# Altium project Compuertas.PrjPcb
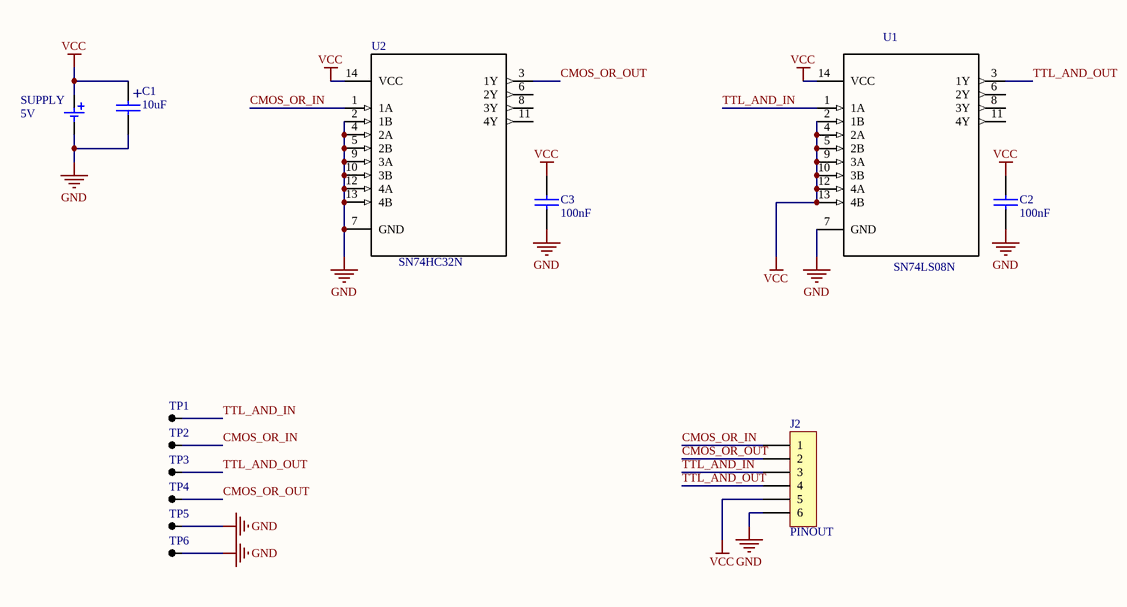
[diagram p0: Compuertas_SCH.SchDoc]
1 sheet, 13 parts. Net scope: global (net labels, ports and power ports of the same name join across sheets).
Board file: Compuertas_PCB.PcbDoc

## Sheet Compuertas_SCH.SchDoc
size A4

### Parts
C1  10uF  [CAP100RP]
C2  100nF  [0805]
C3  100nF  [0805]
J2  PINOUT  [SIP6]
SUPPLY  5V  [BORNERA2]
TP1  TP  [TPTH]  (value not drawn)
TP2  TP  [TPTH]  (value not drawn)
TP3  TP  [TPTH]  (value not drawn)
TP4  TP  [TPTH]  (value not drawn)
TP5  TP  [TPTH]  (value not drawn)
TP6  TP  [TPTH]  (value not drawn)
U1  SN74LS08N  [*DIP254P762X508-14]
U2  SN74HC32N  [*DIP254P762X508-14]

### Nets
GND: C1.2 C2.2 C3.2 J2.6 SUPPLY.2 TP5.1 TP6.1 U1.7(GND) U2.2(1B) U2.4(2A) U2.5(2B) U2.7(GND) U2.9(3A) U2.10(3B) U2.12(4A) U2.13(4B)
VCC: C1.1 C2.1 C3.1 J2.5 SUPPLY.1 U1.2(1B) U1.4(2A) U1.5(2B) U1.9(3A) U1.10(3B) U1.12(4A) U1.13(4B) U1.14(VCC) U2.14(VCC)
CMOS_OR_IN: J2.1 TP2.1 U2.1(1A)
CMOS_OR_OUT: J2.2 TP4.1 U2.3(1Y)
TTL_AND_IN: J2.3 TP1.1 U1.1(1A)
TTL_AND_OUT: J2.4 TP3.1 U1.3(1Y)

Not connected (* = marked no-connect by the designer): U1 6(2Y) 8(3Y) 11(4Y); U2 6(2Y) 8(3Y) 11(4Y)

### Notes on the sheet
- (in symbol CAPPOL) +

### Library data of the parts
C1 = CAPPOL: Value: Electrolítico 10uF; Footprint: THT
C2 C3 = CAP: Value: Cerámico 100nF; Footprint: SMD 0805
J2 = CON6: Value: Pin Macho; Footprint: Pin Macho
SUPPLY = BATERIA: Value: BORNERA2
TP1-TP6 = TP: Value: Pin Macho; Footprint: THT
U1 = SN74LS08N: AND Gate 4 Element 2 Input Bipolar 14-Pin Plastic DIP Tube; Value: 74LS08; Footprint: THT DIP14
U2 = SN74HC32N: IC: digital; Channels: 4; OR; Inputs: 2; THT; DIP14; Seri; Value: 74HC32; Footprint: THT DIP14